# EAGLE design rectifier test (EAGLE 8.3.1)
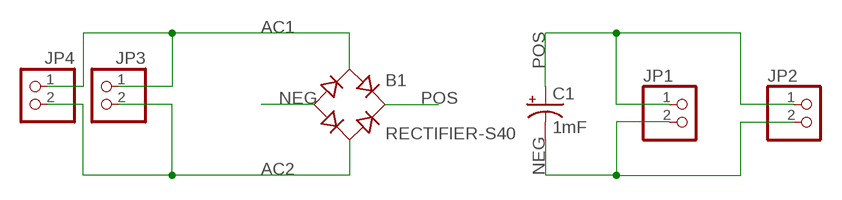
[diagram p0: schematic, sheet 1]

## Parts
B1  RECTIFIER-S40  [TO-269AA]
C1  1mF  1000UF-RADIAL-5MM-25V-20%  [CPOL-RADIAL-5MM-10MM]
JP1  PINHD-1X2  [1X02]
JP2  PINHD-1X2  [1X02]
JP3  PINHD-1X2  [1X02]
JP4  PINHD-1X2  [1X02]

## Nets
AC1: B1.AC1 JP3.1 JP4.1
AC2: B1.AC2 JP3.2 JP4.2
NEG: B1.- C1.- JP1.2 JP2.2
POS: B1.+ C1.+ JP1.1 JP2.1

## Library data of the parts
B1 = rectifier:RECTIFIER-: Rectifier
C1 = SparkFun-Capacitors:1000UF: 1,000µF/1mF ceramic capacitors A capacitor is a passive two-terminal electrical component used to store electrical energy temporarily in an electric field. CAP-08070; PROD_ID: CAP-09538
JP1-JP4 = pinhead:PINHD-1X2: PIN HEADER

## Board
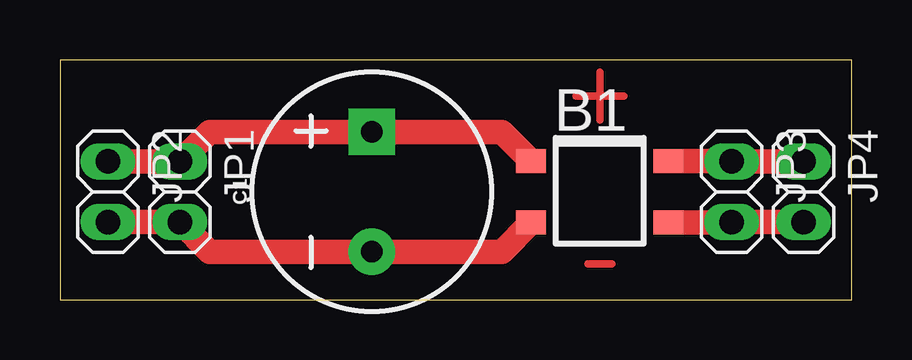
[diagram p1: board, top side]

Size 33 x 10 mm. Coordinates in mm from the lower left corner, seen from the top.
Outline: 0,0 33,0 33,10 0,10 0,0
Copper layers (1*16): Top 0.035mm / dielectric 1.5mm / Bottom 0.035mm
Design rules "OthermillDRC_1_32_v2": minimum track width 8mil, minimum drill 0.8mm, track to track 0.794003125mm, track to pad 0.794003125mm, pad to pad 0.794003125mm, via to via 0.794003125mm, smd to smd 0mil, copper to edge 0mil, drill to drill 1mil, minimum pad ring 10mil, minimum via ring 10mil, stop-mask expansion 1mil, vias tented up to drill 30mil, thermal gap 10mil

### Footprints (pad centres in the part's own frame; a part is rotated, then mirrored left to right if it is on the bottom)
TO-269AA = smd 1 x 1.25: + -1.28,-2.855; - 1.28,-2.855; AC1 -1.28,2.855; AC2 1.28,2.855
CPOL-RADIAL-5MM-10MM = drill 0.9 pad 1.93 square: + 2.5,0 | drill 0.9 pad 1.93: - -2.5,0
1X02 = drill 1.016 long: 1 -1.27,0; 2 1.27,0

### Placement (x,y rotation side)
B1  22.5,4.5 270 top
C1  13,4.5 90 top
JP1  5,4.5 270 top
JP2  2,4.5 270 top
JP3  28,4.5 270 top
JP4  31,4.5 270 top

### Tracks (layer width: path | path; a pad name or v marks a point on that pad's centre or on a via)
AC1
  Top 1.016: B1.AC1 JP3.1 JP4.1
AC2
  Top 1.016: B1.AC2 JP3.2 JP4.2
N$1
  Top 0.305: 22.5,7.5 22.5,9.5
N$2
  Top 0.305: 21.5,8.5 23.5,8.5
N$3
  Top 0.305: 22,1.5 23,1.5
NEG
  Top 1.016: B1.- 18.43,2 C1.- 6.23,2 JP1.2 JP2.2
POS
  Top 1.016: JP2.1 JP1.1 6.23,7 C1.+ 18.43,7 B1.+